# Altium schematic sheet Data Process System.SchDoc
size A4
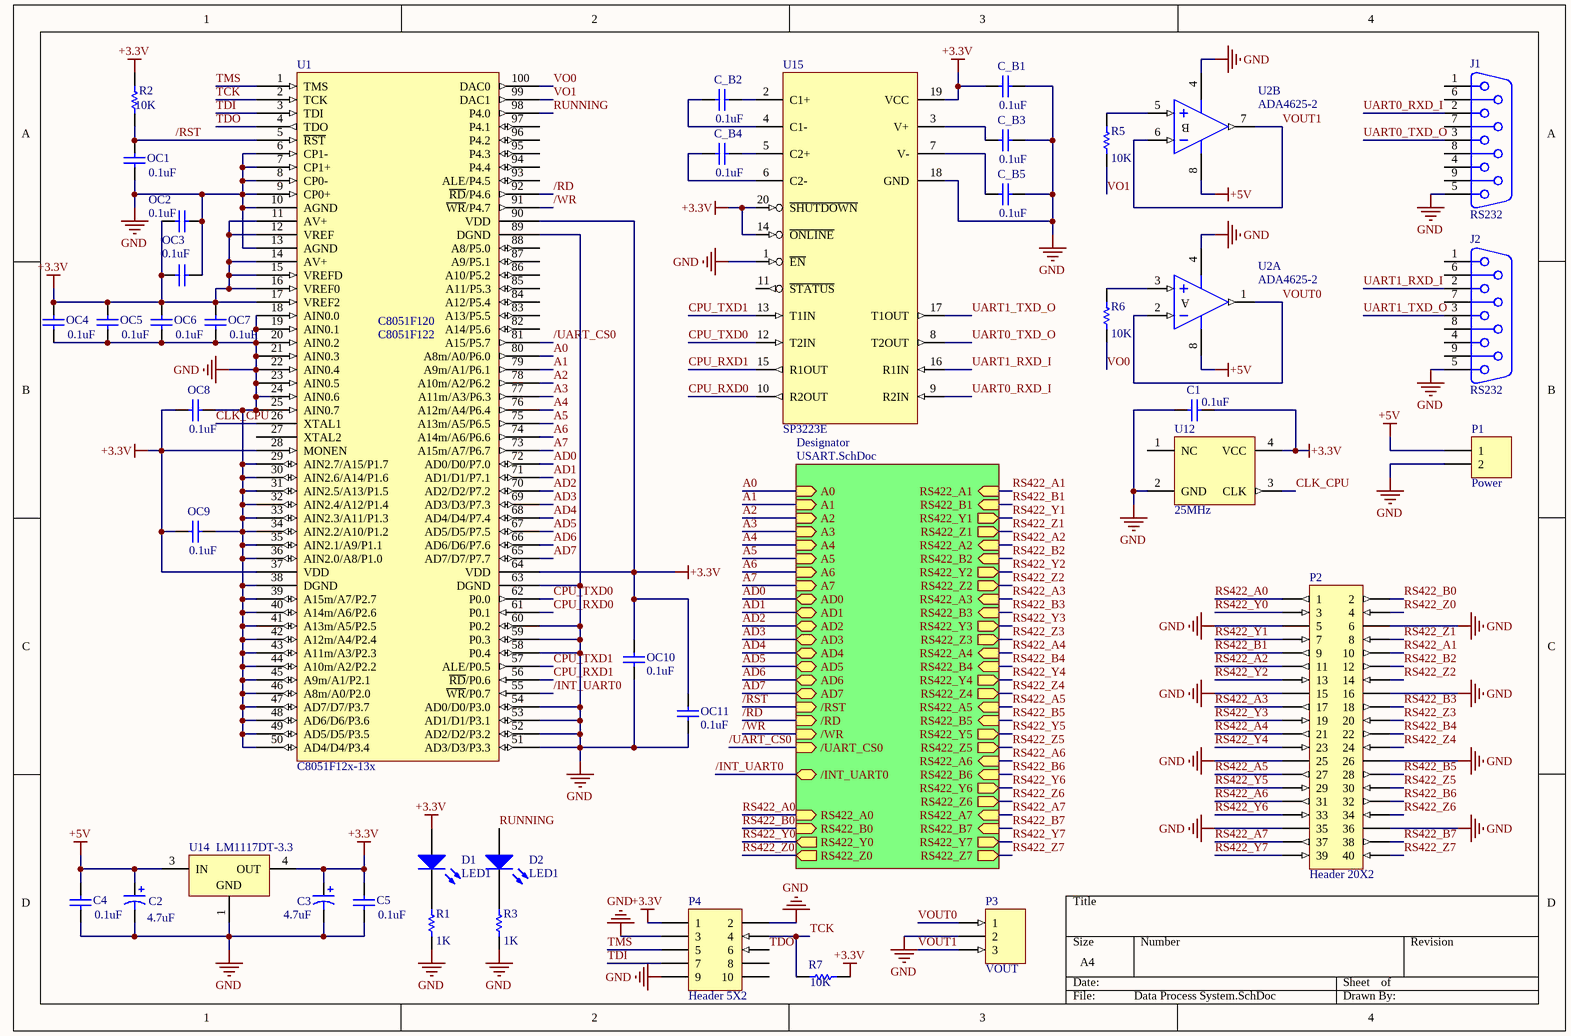
[diagram p0: Data Process System.SchDoc]

## Parts
C1  value 0.1uF  [0805]  (hidden comment: Cap 0.1uf)
C2  value 4.7uF  [3528]  (hidden comment: Cap Pol 4.7uf)
C3  value 4.7uF  [3528]  (hidden comment: Cap Pol 4.7uf)
C4  value 0.1uF  [0805]  (hidden comment: Cap 0.1uf)
C5  value 0.1uF  [0805]  (hidden comment: Cap 0.1uf)
C_B1  value 0.1uF  [0805]  (hidden comment: Cap 0.1uf)
C_B2  value 0.1uF  [0805]  (hidden comment: Cap 0.1uf)
C_B3  value 0.1uF  [0805]  (hidden comment: Cap 0.1uf)
C_B4  value 0.1uF  [0805]  (hidden comment: Cap 0.1uf)
C_B5  value 0.1uF  [0805]  (hidden comment: Cap 0.1uf)
D1  LED1  [3216]
D2  LED1  [3216]
J1  RS232  [DSUB1.385-2H9]
J2  RS232  [DSUB1.385-2H9]
OC1  value 0.1uF  [0805]  (hidden comment: Cap 0.1uf)
OC2  value 0.1uF  [0805]  (hidden comment: Cap 0.1uf)
OC3  value 0.1uF  [0805]  (hidden comment: Cap 0.1uf)
OC4  value 0.1uF  [0805]  (hidden comment: Cap 0.1uf)
OC5  value 0.1uF  [0805]  (hidden comment: Cap 0.1uf)
OC6  value 0.1uF  [0805]  (hidden comment: Cap 0.1uf)
OC7  value 0.1uF  [0805]  (hidden comment: Cap 0.1uf)
OC8  value 0.1uF  [0805]  (hidden comment: Cap 0.1uf)
OC9  value 0.1uF  [0805]  (hidden comment: Cap 0.1uf)
OC10  value 0.1uF  [0805]  (hidden comment: Cap 0.1uf)
OC11  value 0.1uF  [0805]  (hidden comment: Cap 0.1uf)
P1  Power  [HDR1X2]
P2  Header 20X2  [HDR2X20]
P3  VOUT  [HDR1X3]
P4  Header 5X2  [HDR2X5]
R1  1k  [0805]
R2  10k  [0805]
R3  1k  [0805]
R5  10k  [0805]
R6  10k  [0805]
R7  10k  [0805]
U1  C8051F12x-13x  [TSQFP50P1600X1600X120-100N]
U2  ADA4625-2  [SO-8_L]  (parts A,B of 2)
U12  25MHz  [my_SiT8103]
U14  LM1117DT-3.3  [TD03B_N]
U15  SP3223E  [SOP65P800X200-20N]

## Sub-sheets
Designator = USART.SchDoc: /UART_CS0 (in), /INT_UART0 (bidir), RS422_A0 (in), RS422_B0 (in), RS422_Y0 (out), RS422_Z0 (out), A0 (in), A1 (in), A2 (in), A3 (in), A4 (in), A5 (in), A6 (in), A7 (in), AD0 (bidir), AD1 (bidir), AD2 (bidir), AD3 (bidir), AD4 (bidir), AD5 (bidir), AD6 (bidir), AD7 (bidir), /RST (in), /RD (in), /WR (in), RS422_Y1 (out), RS422_Z1 (out), RS422_A2 (in), RS422_B2 (in), RS422_Y2 (out), RS422_Z2 (out), RS422_A3 (in), RS422_B3 (in), RS422_Y3 (out), RS422_Z3 (out), RS422_A4 (in), RS422_B4 (in), RS422_Y4 (out), RS422_Z4 (out), RS422_A5 (in), RS422_B5 (in), RS422_Y5 (out), RS422_Z5 (out), RS422_A6 (in), RS422_B6 (in), RS422_Y6 (out), RS422_Z6 (out), RS422_A7 (in), RS422_B7 (in), RS422_Y7 (out), RS422_Z7 (out), RS422_A1 (in), RS422_B1 (in)

## Nets
+3.3V: C1.1 C3.1 C5.2 C_B1.1 D1.1(A) OC2.1 OC3.1 OC4.2 OC5.2 OC6.2 OC7.2 OC8.1 OC9.1 OC10.2 OC11.2 P4.1 R2.2 R7.2 U1.11(AV+) U1.12(VREF) U1.14(AV+) U1.15(VREFD) U1.16(VREF0) U1.17(VREF2) U1.28(MONEN) U1.37(VDD) U1.64(VDD) U1.90(VDD) U12.4(VCC) U14.4(OUT) U15.14(~{ONLINE}) U15.19(VCC) U15.20(~{SHUTDOWN})
+5V: C2.1 C4.2 P1.1 U2.8(V+) U14.3(IN)
GND: C1.2 C2.2 C3.2 C4.1 C5.1 C_B1.2 C_B3.2 C_B5.2 J1.5 J2.5 OC1.1 OC2.2 OC3.2 OC4.1 OC5.1 OC6.1 OC7.1 OC8.2 OC9.2 OC10.1 OC11.1 P1.2 P2.5 P2.6 P2.15 P2.16 P2.25 P2.26 P2.35 P2.36 P3.2 P4.2 P4.3 P4.9 R1.1 R3.1 U1.6(CP1-) U1.7(CP1+) U1.8(CP0-) U1.9(CP0+) U1.10(AGND) U1.13(AGND) U1.18(AIN0.0) U1.19(AIN0.1) U1.20(AIN0.2) U1.21(AIN0.3) U1.22(AIN0.4) U1.23(AIN0.5) U1.24(AIN0.6) U1.25(AIN0.7) U1.29(AIN2.7/A15/P1.7) U1.30(AIN2.6/A14/P1.6) U1.31(AIN2.5/A13/P1.5) U1.32(AIN2.4/A12/P1.4) U1.33(AIN2.3/A11/P1.3) U1.34(AIN2.2/A10/P1.2) U1.35(AIN2.1/A9/P1.1) U1.36(AIN2.0/A8/P1.0) U1.38(DGND) U1.39(A15m/A7/P2.7) U1.40(A14m/A6/P2.6) U1.41(A13m/A5/P2.5) U1.42(A12m/A4/P2.4) U1.43(A11m/A3/P2.3) U1.44(A10m/A2/P2.2) U1.45(A9m/A1/P2.1) U1.46(A8m/A0/P2.0) U1.47(AD7/D7/P3.7) U1.48(AD6/D6/P3.6) U1.49(AD5/D5/P3.5) U1.50(AD4/D4/P3.4) U1.51(AD3/D3/P3.3) U1.52(AD2/D2/P3.2) U1.53(AD1/D1/P3.1) U1.54(AD0/D0/P3.0) U1.58(P0.4) U1.59(P0.3) U1.60(P0.2) U1.63(DGND) U1.89(DGND) U2.4(V-) U12.2(GND) U14.1(GND) U15.1(~{EN}) U15.18(GND)
/INT_UART0: U1.55(~{WR}/P0.7) ; sheet Designator//INT_UART0
/RD: U1.92(~{RD}/P4.6) ; sheet Designator//RD
/RST: OC1.2 R2.1 U1.5(~{RST}) ; sheet Designator//RST
/UART_CS0: U1.81(A15/P5.7) ; sheet Designator//UART_CS0
/WR: U1.91(~{WR}/P4.7) ; sheet Designator//WR
A0: U1.80(A8m/A0/P6.0) ; sheet Designator/A0
A1: U1.79(A9m/A1/P6.1) ; sheet Designator/A1
A2: U1.78(A10m/A2/P6.2) ; sheet Designator/A2
A3: U1.77(A11m/A3/P6.3) ; sheet Designator/A3
A4: U1.76(A12m/A4/P6.4) ; sheet Designator/A4
A5: U1.75(A13m/A5/P6.5) ; sheet Designator/A5
A6: U1.74(A14m/A6/P6.6) ; sheet Designator/A6
A7: U1.73(A15m/A7/P6.7) ; sheet Designator/A7
AD0: U1.72(AD0/D0/P7.0) ; sheet Designator/AD0
AD1: U1.71(AD1/D1/P7.1) ; sheet Designator/AD1
AD2: U1.70(AD2/D2/P7.2) ; sheet Designator/AD2
AD3: U1.69(AD3/D3/P7.3) ; sheet Designator/AD3
AD4: U1.68(AD4/D4/P7.4) ; sheet Designator/AD4
AD5: U1.67(AD5/D5/P7.5) ; sheet Designator/AD5
AD6: U1.66(AD6/D6/P7.6) ; sheet Designator/AD6
AD7: U1.65(AD7/D7/P7.7) ; sheet Designator/AD7
CLK_CPU: U1.26(XTAL1) U12.3(CLK)
CPU_RXD0: U1.61(P0.1) U15.10(R2OUT)
CPU_RXD1: U1.56(~{RD}/P0.6) U15.15(R1OUT)
CPU_TXD0: U1.62(P0.0) U15.12(T2IN)
CPU_TXD1: U1.57(ALE/P0.5) U15.13(T1IN)
RS422_A0: P2.1 ; sheet Designator/RS422_A0
RS422_A1: P2.10 ; sheet Designator/RS422_A1
RS422_A2: P2.11 ; sheet Designator/RS422_A2
RS422_A3: P2.17 ; sheet Designator/RS422_A3
RS422_A4: P2.21 ; sheet Designator/RS422_A4
RS422_A5: P2.27 ; sheet Designator/RS422_A5
RS422_A6: P2.31 ; sheet Designator/RS422_A6
RS422_A7: P2.37 ; sheet Designator/RS422_A7
RS422_B0: P2.2 ; sheet Designator/RS422_B0
RS422_B1: P2.9 ; sheet Designator/RS422_B1
RS422_B2: P2.12 ; sheet Designator/RS422_B2
RS422_B3: P2.18 ; sheet Designator/RS422_B3
RS422_B4: P2.22 ; sheet Designator/RS422_B4
RS422_B5: P2.28 ; sheet Designator/RS422_B5
RS422_B6: P2.32 ; sheet Designator/RS422_B6
RS422_B7: P2.38 ; sheet Designator/RS422_B7
RS422_Y0: P2.3 ; sheet Designator/RS422_Y0
RS422_Y1: P2.7 ; sheet Designator/RS422_Y1
RS422_Y2: P2.13 ; sheet Designator/RS422_Y2
RS422_Y3: P2.19 ; sheet Designator/RS422_Y3
RS422_Y4: P2.23 ; sheet Designator/RS422_Y4
RS422_Y5: P2.29 ; sheet Designator/RS422_Y5
RS422_Y6: P2.33 ; sheet Designator/RS422_Y6
RS422_Y7: P2.39 ; sheet Designator/RS422_Y7
RS422_Z0: P2.4 ; sheet Designator/RS422_Z0
RS422_Z1: P2.8 ; sheet Designator/RS422_Z1
RS422_Z2: P2.14 ; sheet Designator/RS422_Z2
RS422_Z3: P2.20 ; sheet Designator/RS422_Z3
RS422_Z4: P2.24 ; sheet Designator/RS422_Z4
RS422_Z5: P2.30 ; sheet Designator/RS422_Z5
RS422_Z6: P2.34 ; sheet Designator/RS422_Z6
RS422_Z7: P2.40 ; sheet Designator/RS422_Z7
RUNNING: D2.1(A) U1.98(P4.0)
TCK: P4.4 R7.1 U1.2(TCK)
TDI: P4.7 U1.3(TDI)
TDO: P4.6 U1.4(TDO)
TMS: P4.5 U1.1(TMS)
UART0_RXD_I: J1.2 U15.9(R2IN)
UART0_TXD_O: J1.3 U15.8(T2OUT)
UART1_RXD_I: J2.2 U15.16(R1IN)
UART1_TXD_O: J2.3 U15.17(T1OUT)
VO0: R6.2 U1.100(DAC0)
VO1: R5.2 U1.99(DAC1)
VOUT0: P3.1 U2.1(OUT) U2.2(IN-)
VOUT1: P3.3 U2.6(IN-) U2.7(OUT)
NetC_B2_1: C_B2.1 U15.4(C1-)
NetC_B2_2: C_B2.2 U15.2(C1+)
NetC_B3_1: C_B3.1 U15.3(V+)
NetC_B4_1: C_B4.1 U15.6(C2-)
NetC_B4_2: C_B4.2 U15.5(C2+)
NetC_B5_1: C_B5.1 U15.7(V-)
NetD1_2: D1.2(K) R1.2
NetD2_2: D2.2(K) R3.2
NetR5_1: R5.1 U2.5(IN+)
NetR6_1: R6.1 U2.3(IN+)

Not connected (* = marked no-connect by the designer): J1 1 4 6 7 8 9; J2 1 4 6 7 8 9; P4 8 10; U1 27(XTAL2) 82(A14/P5.6) 83(A13/P5.5) 84(A12/P5.4) 85(A11/P5.3) 86(A10/P5.2) 87(A9/P5.1) 88(A8/P5.0) 93(ALE/P4.5) 94(P4.4) 95(P4.3) 96(P4.2) 97(P4.1); U12 1(NC); U15 11(~{STATUS})

## Notes on the sheet
- (in symbol COMPONENT_1) C8051F120; C8051F122
- (in symbol OP297GS, part A) A
- (in symbol OP297GS, part B) B

## Library data of the parts
C1 C4 C5 C_B1-C_B5 OC1-OC11 = Cap: Capacitor; Published: 8-Jun-2000; LatestRevisionDate: 17-Jul-2002; LatestRevisionNote: Re-released for DXP Platform.; PackageReference: RAD-0.3; Publisher: Altium Limited; PackageDescription: Radial Cap, Thru-Hole; 2 Leads; 0.3 in Pin Spacing
C2 C3 = Cap Pol3: Polarized Capacitor (Surface Mount); Published: 8-Jun-2000; LatestRevisionDate: 29-May-2009; LatestRevisionNote: IPC-7351 Footprint Added.; PackageReference: C0805; Publisher: Altium Limited; PackageDescription: Chip Capacitor
D1 D2 = LED1: Typical RED GaAs LED; Published: 8-Jun-2000; LatestRevisionDate: 08-Jul-2005; LatestRevisionNote: Mech Layer 1 removed.; PackageReference: LED-1; Publisher: Altium Limited; PackageDescription: LED; 2 Leads
J1 J2 = D Connector 9: Receptacle Assembly, 9 Position, Right Angle; PackageDocument: O; Positions: 9; Published: 15-Jun-2001; LatestRevisionDate: 17-Jul-2002; LatestRevisionNote: Re-released for DXP Platform.; DatasheetDocument: 1-Sep-1999; PackageReference: 788750; Publisher: Altium Limited; Orientation: Right Angle; Gender: Receptacle
P1 = Header 2: Header, 2-Pin; LatestRevisionDate: 17-Jul-2002; LatestRevisionNote: Re-released for DXP Platform.; Publisher: Altium Limited
P2 = Header 20X2: Header, 20-Pin, Dual row; LatestRevisionDate: 17-Jul-2002; LatestRevisionNote: Re-released for DXP Platform.; Publisher: Altium Limited
P3 = Header 3: Header, 3-Pin; LatestRevisionDate: 17-Jul-2002; LatestRevisionNote: Re-released for DXP Platform.; Publisher: Altium Limited
P4 = Header 5X2: Header, 5-Pin, Dual row; LatestRevisionDate: 17-Jul-2002; LatestRevisionNote: Re-released for DXP Platform.; Publisher: Altium Limited
R1-R3 R5-R7 = Res1: Resistor; Published: 8-Jun-2000; LatestRevisionDate: 17-Jul-2002; LatestRevisionNote: Re-released for DXP Platform.; PackageReference: AXIAL-0.3; Publisher: Altium Limited; PackageDescription: Axial Device, Thru-Hole; 2 Leads; 0.3 in Pin Spacing
  R1 R3: Value: 1K
  R2 R5-R7: Value: 10K
U1 = COMPONENT_1
U2 = OP297GS: Dual Low-Bias-Current Precision Operational Amplifier; Published: 8-Jun-2000; LatestRevisionDate: 13-Apr-2006; LatestRevisionNote: IPC-7351 Footprint Added.; DatasheetVersion: REV. D 1997; PackageVersion: revA; PackageReference: SO-8; Publisher: Altium Limited; PackageDescription: 8-Pin Small Outline Integrated Circuit 1.27 mm Pitch; Code_JEDEC: MS-012-AA; Code_IPC: SOIC127P600-8; ComponentLink1Description: Manufacturer Link; ComponentLink1URL: http://www.analog.com/en/prod/0,,759_786_OP297%2C00.html; ComponentLink2Description: Datasheet; ComponentLink2URL: http://www.analog.com/UploadedFiles/Data_Sheets/36971711685OP297_e_.pdf; ComponentLink3Description: Discontinuation Notice; ComponentLink3URL: http://www.analog.com/UploadedFiles/Aerospace_Information/505817548385948813507767505obsolete.pdf
U12 = my_SiT8103
U14 = LM1117DT-3.3: 800mA Low-Dropout Linear Regulator, 3-pin TO-252; Manufacturer: National Semiconductor; PackageTopMarking: NSUZXYTT*LM1117*DT-3.3; PowerWise: N; CompType: LDO IC; Published: 4-Dec-2008; DatasheetVersion: Apr-2006; PackageVersion: revD, Feb-2009; PackageReference: TD03B; Publisher: Altium Limited; PackageDescription: TO252, Molded, Jedec, 6.8 x 6.10 x 2.30mm Body, 3 Lead, 2.28mm Pitch, Surface Mount; Supplier 1: Farnell; Supplier Part Number 1: 9486275; Supplier 2: Farnell; Supplier Part Number 2: 1523829; PartNumber: LM1117DT-3.3; RoHS: N; PinCount: 3; Code_JEDEC: TO-252-AA; ComponentLink1Description: LM1117 Datasheet; ComponentLink1URL: http://www.national.com/ds/LM/LM1117.pdf; ComponentLink2Description: LM1117 Web Page; ComponentLink2URL: http://www.national.com/pf/LM/LM1117.html; ComponentLink3Description: TD03B Package Page; ComponentLink3URL: http://www.national.com/packaging/folders/td03b.html
U15 = my_SP3223E